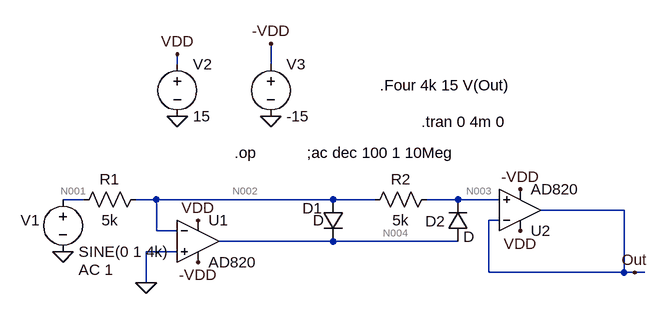
[diagram p0: schematic Redresor.asc]
Redresor.asc, the LTspice schematic file:
Version 4
SHEET 1 960 680
WIRE 144 -128 144 -144
WIRE 288 -128 288 -160
WIRE 0 80 -32 80
WIRE 112 80 80 80
WIRE 384 80 112 80
WIRE 448 80 384 80
WIRE 576 80 528 80
WIRE 640 80 576 80
WIRE 832 96 704 96
WIRE 640 112 624 112
WIRE 112 128 112 80
WIRE 144 128 112 128
WIRE 384 144 208 144
WIRE 576 144 384 144
WIRE 144 160 96 160
WIRE 624 192 624 112
WIRE 832 192 832 96
WIRE 832 192 624 192
WIRE 848 192 832 192
WIRE 864 192 848 192
WIRE 96 208 96 160
FLAG 96 208 0
FLAG -32 160 0
FLAG 144 -144 VDD
FLAG 288 -160 -VDD
FLAG 288 -48 0
FLAG 144 -48 0
FLAG 176 112 VDD
FLAG 672 128 VDD
FLAG 176 176 -VDD
FLAG 672 64 -VDD
FLAG 848 192 Out
DATAFLAG 560 80 ""
DATAFLAG 528 144 ""
DATAFLAG 128 160 ""
DATAFLAG 832 192 ""
DATAFLAG 832 192 ""
DATAFLAG 832 192 ""
DATAFLAG 832 192 ""
DATAFLAG 832 192 ""
SYMBOL res 96 64 R90
WINDOW 0 0 56 VBottom 2
WINDOW 3 32 56 VTop 2
SYMATTR InstName R1
SYMATTR Value 5k
SYMBOL OpAmps\\AD820 176 80 R0
SYMATTR InstName U1
SYMBOL diode 368 80 R0
WINDOW 0 -31 13 Left 2
WINDOW 3 -15 32 Left 2
SYMATTR InstName D1
SYMBOL res 544 64 R90
WINDOW 0 0 56 VBottom 2
WINDOW 3 32 56 VTop 2
SYMATTR InstName R2
SYMATTR Value 5k
SYMBOL diode 592 144 R180
WINDOW 0 35 31 Left 2
WINDOW 3 -10 7 Left 2
SYMATTR InstName D2
SYMBOL OpAmps\\AD820 672 160 M180
SYMATTR InstName U2
SYMBOL voltage -32 64 R0
WINDOW 0 -65 48 Left 2
WINDOW 123 24 124 Left 2
WINDOW 39 0 0 Left 0
SYMATTR InstName V1
SYMATTR Value2 AC 1
SYMATTR Value SINE(0 1 4k)
SYMBOL voltage 144 -144 R0
WINDOW 123 0 0 Left 0
WINDOW 39 0 0 Left 0
SYMATTR InstName V2
SYMATTR Value 15
SYMBOL voltage 288 -144 R0
WINDOW 123 0 0 Left 0
WINDOW 39 0 0 Left 0
SYMATTR InstName V3
SYMATTR Value -15
TEXT 232 8 Left 2 !.op
TEXT 344 8 Left 2 !;ac dec 100 1 10Meg
TEXT 520 -40 Left 2 !.tran 0 4m 0
TEXT 456 -96 Left 2 !.Four 4k 15 V(Out)

The netlist it stands for:
* Redresor.asc
R1 N002 N001 5k
XU1 0 N002 VDD -VDD N004 AD820  ; pins In+ In- V+ V- OUT
D1 N002 N004 D
R2 N003 N002 5k
D2 N004 N003 D
XU2 N003 Out VDD -VDD Out AD820  ; pins In+ In- V+ V- OUT
V1 N001 0 SINE(0 1 4k) AC 1
V2 VDD 0 15
V3 -VDD 0 -15
.model D D
.lib standard.dio
.op
;ac dec 100 1 10Meg
.tran 0 4m 0
.Four 4k 15 V(Out)
.backanno
.end

* Results of the author's LTspice run, read from the files saved beside the schematic
* Operating Point, zero values left out:
*   V(vdd) = 15 V
*   V(-vdd) = -15 V
*   V(n004) = 145.2 mV
*   I(D2) = 2.879 pA
*   I(V2) = -1.415 mA
*   I(V3) = 1.415 mA
*   Ix(u1:1) = 2 pA
*   Ix(u1:2) = 2 pA
*   Ix(u1:3) = 707.6 µA
*   Ix(u1:4) = -707.6 µA
*   Ix(u1:5) = -3.034 pA
*   Ix(u2:1) = 2 pA
*   Ix(u2:2) = 2 pA
*   Ix(u2:3) = 707.5 µA
*   Ix(u2:4) = -707.5 µA
*   Ix(u2:5) = -2 pA
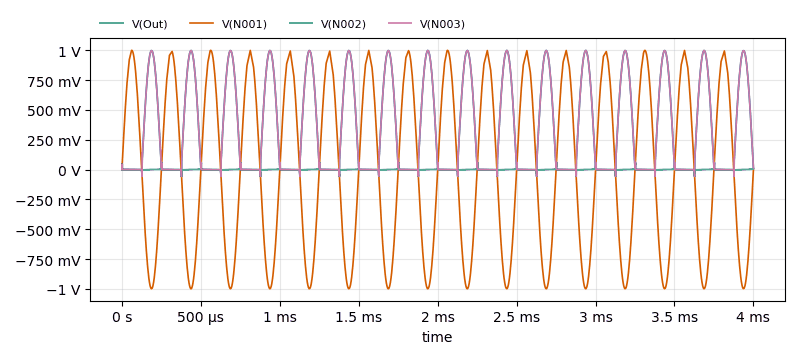
[diagram p1: Transient Analysis of Redresor.asc, plotted from the saved traces]
* Transient Analysis, 1 run:
*   V(Out): min -57.12 mV, max 999.3 mV, average 317.1 mV, rms 498.9 mV, last 13.92 mV
*   V(N001): min -999.9 mV, max 999.7 mV, average -3.413 mV, rms 703.9 mV, last 0 V
*   V(N002): min -57.95 mV, max 57.96 mV, average -5.097 µV, rms 5.194 mV, last 6.483 mV
*   V(N003): min -57.05 mV, max 999.2 mV, average 317.1 mV, rms 498.8 mV, last 13.02 mV
* From the log:
*   N-Period=1
*   Fourier components of V(out)
*   DC component:0.317062
*   Harmonic  Frequency   Fourier   Normalized   Phase    Normalized
*    Number     [Hz]     Component   Component  [degree]  Phase [deg]
*       1      4.000e+3   4.984e-1   1.000e+0    -89.40°      0.00°
*       2      8.000e+3   2.121e-1   4.256e-1   -179.30°    -89.90°
*       3      1.200e+4   2.095e-3   4.204e-3      7.96°     97.36°
*       4      1.600e+4   4.278e-2   8.583e-2   -178.52°    -89.12°
*       5      2.000e+4   2.086e-3   4.186e-3      9.17°     98.58°
*       6      2.400e+4   1.870e-2   3.752e-2   -177.34°    -87.94°
*       7      2.800e+4   1.998e-3   4.008e-3     16.29°    105.70°
*       8      3.200e+4   1.059e-2   2.124e-2   -176.26°    -86.86°
*       9      3.600e+4   2.018e-3   4.048e-3     19.85°    109.25°
*      10      4.000e+4   6.939e-3   1.392e-2   -174.20°    -84.79°
*      11      4.400e+4   1.955e-3   3.923e-3     25.50°    114.90°
*      12      4.800e+4   4.956e-3   9.944e-3   -172.21°    -82.81°
*      13      5.200e+4   1.936e-3   3.885e-3     31.01°    120.41°
*      14      5.600e+4   3.736e-3   7.497e-3   -169.69°    -80.28°
*      15      6.000e+4   1.914e-3   3.840e-3     35.66°    125.06°
*   Partial Harmonic Distortion: 43.683093%
*   Total Harmonic Distortion:   43.734413%